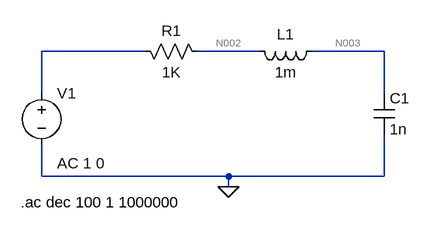
[diagram p0: schematic Diagrama_Ej3.asc]
Diagrama_Ej3.asc, the LTspice schematic file:
Version 4
SHEET 1 880 680
WIRE 128 96 -32 96
WIRE 304 96 208 96
WIRE 496 96 384 96
WIRE -32 160 -32 96
WIRE 496 160 496 96
WIRE -32 288 -32 240
WIRE 256 288 -32 288
WIRE 496 288 496 224
WIRE 496 288 256 288
WIRE 256 304 256 288
FLAG 256 304 0
SYMBOL voltage -32 144 R0
WINDOW 123 24 124 Left 2
WINDOW 39 0 0 Left 0
SYMATTR Value2 AC 1 0
SYMATTR InstName V1
SYMATTR Value ""
SYMBOL ind 400 80 R90
WINDOW 0 5 56 VBottom 2
WINDOW 3 32 56 VTop 2
SYMATTR InstName L1
SYMATTR Value 1m
SYMBOL cap 480 160 R0
SYMATTR InstName C1
SYMATTR Value 1n
SYMBOL res 224 112 M270
WINDOW 0 32 56 VTop 2
WINDOW 3 0 56 VBottom 2
SYMATTR InstName R1
SYMATTR Value 1K
TEXT -64 328 Left 2 !.ac dec 100 1 1000000

The netlist it stands for:
* Diagrama_Ej3.asc
V1 N001 0 AC 1 0
L1 N003 N002 1m
C1 N003 0 1n
R1 N002 N001 1K
.ac dec 100 1 1000000
.backanno
.end

* Results of the author's LTspice run, read from the files saved beside the schematic
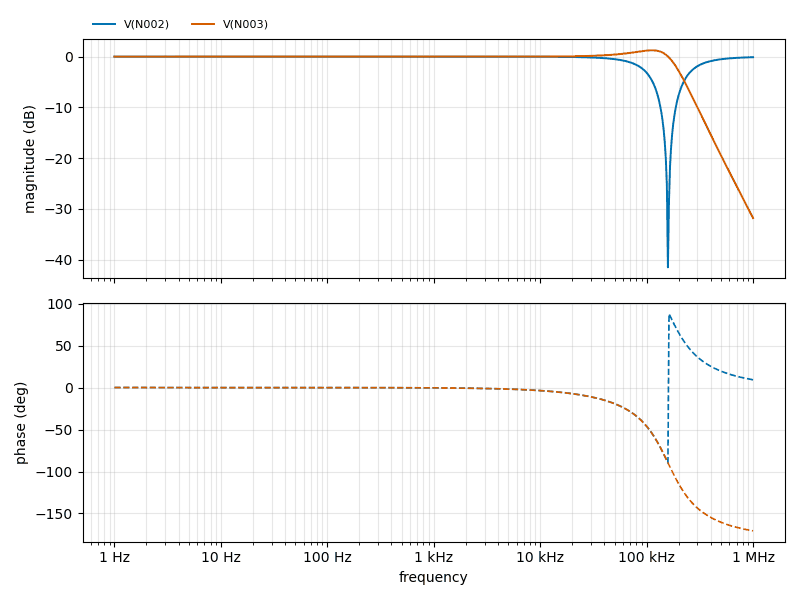
[diagram p1: AC Analysis of Diagrama_Ej3.asc, plotted from the saved traces]
* AC Analysis, 1 run:
*   V(N002): -0.00 dB at 1 Hz, -0.11 dB at 1 MHz, peak -0.00 dB at 1 Hz, 3 dB below the peak at 98.34 kHz
*   V(N003): 0.00 dB at 1 Hz, -31.82 dB at 1 MHz, peak 1.25 dB at 112.2 kHz, 3 dB below the peak at 186 kHz